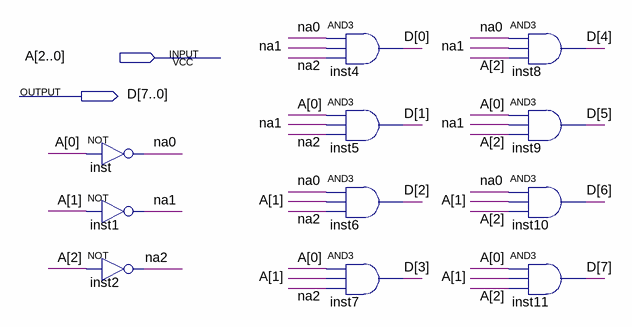
[diagram p0: schematic sheet]
// Quartus schematic DECOD3X8.bdf as structural Verilog: 11 symbols, 2 pins
module DECOD3X8 (
  input  [2:0] A,
  output [7:0] D
);

  wire na0, na1, na2;

  not inst (na0, A[0]);
  not inst1 (na1, A[1]);
  not inst2 (na2, A[2]);
  and inst4 (D[0], na0, na1, na2);
  and inst5 (D[1], A[0], na1, na2);
  and inst6 (D[2], na0, A[1], na2);
  and inst7 (D[3], A[0], A[1], na2);
  and inst8 (D[4], na0, na1, A[2]);
  and inst9 (D[5], A[0], na1, A[2]);
  and inst10 (D[6], na0, A[1], A[2]);
  and inst11 (D[7], A[0], A[1], A[2]);
endmodule
